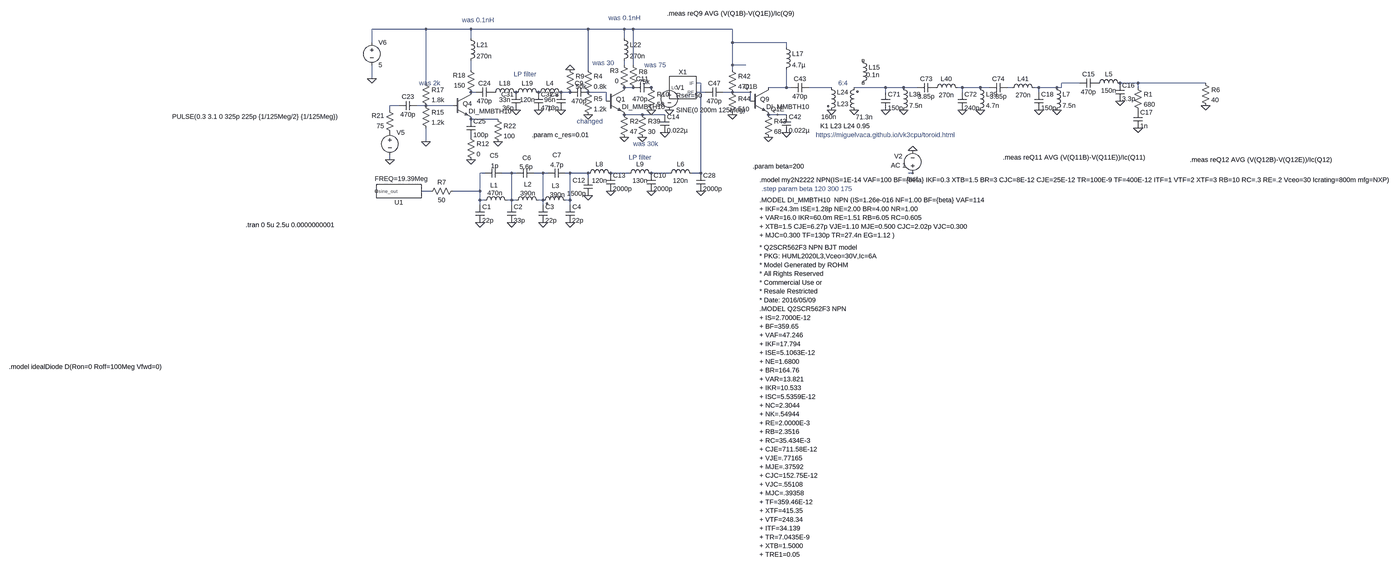
[diagram p0: schematic update_03012022.asc, whole sheet]
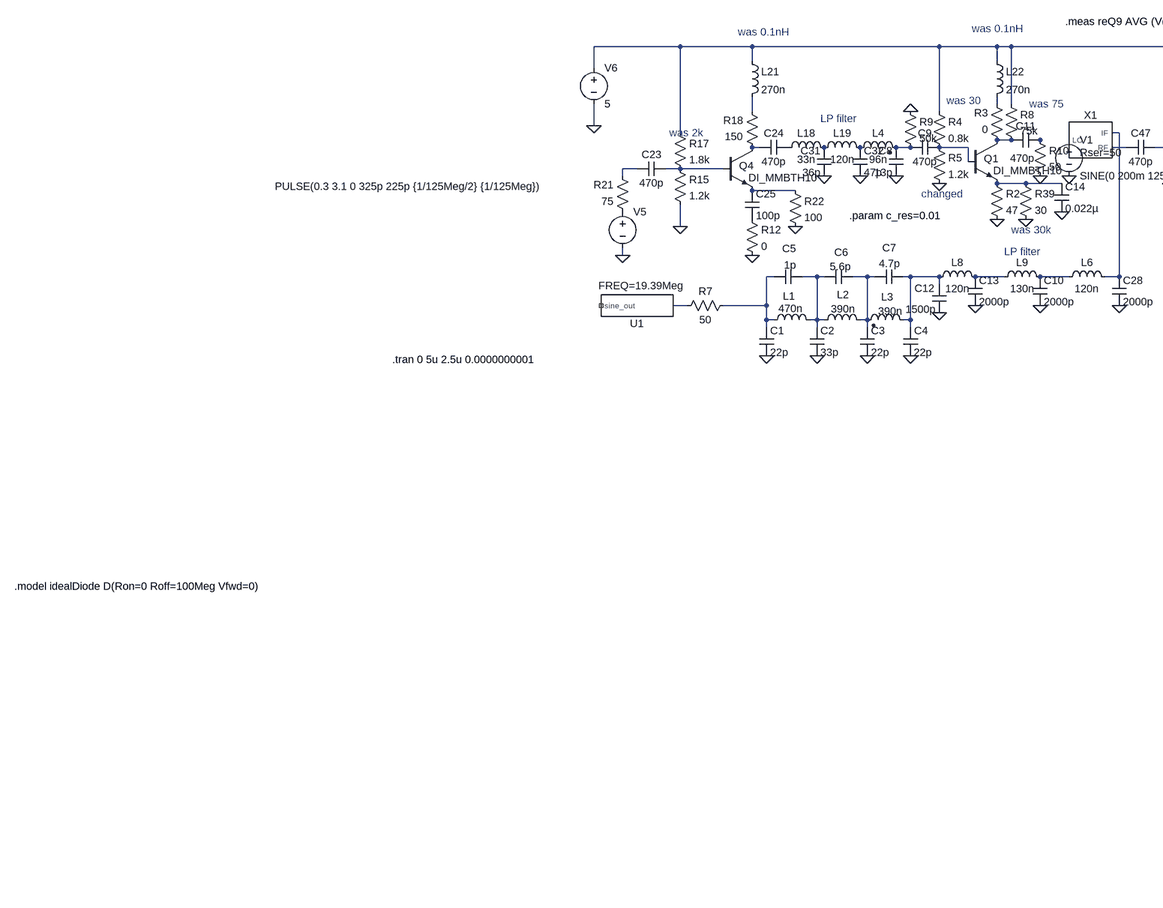
[diagram p1: schematic update_03012022.asc, part, row 1 of 1, column 1 of 2]
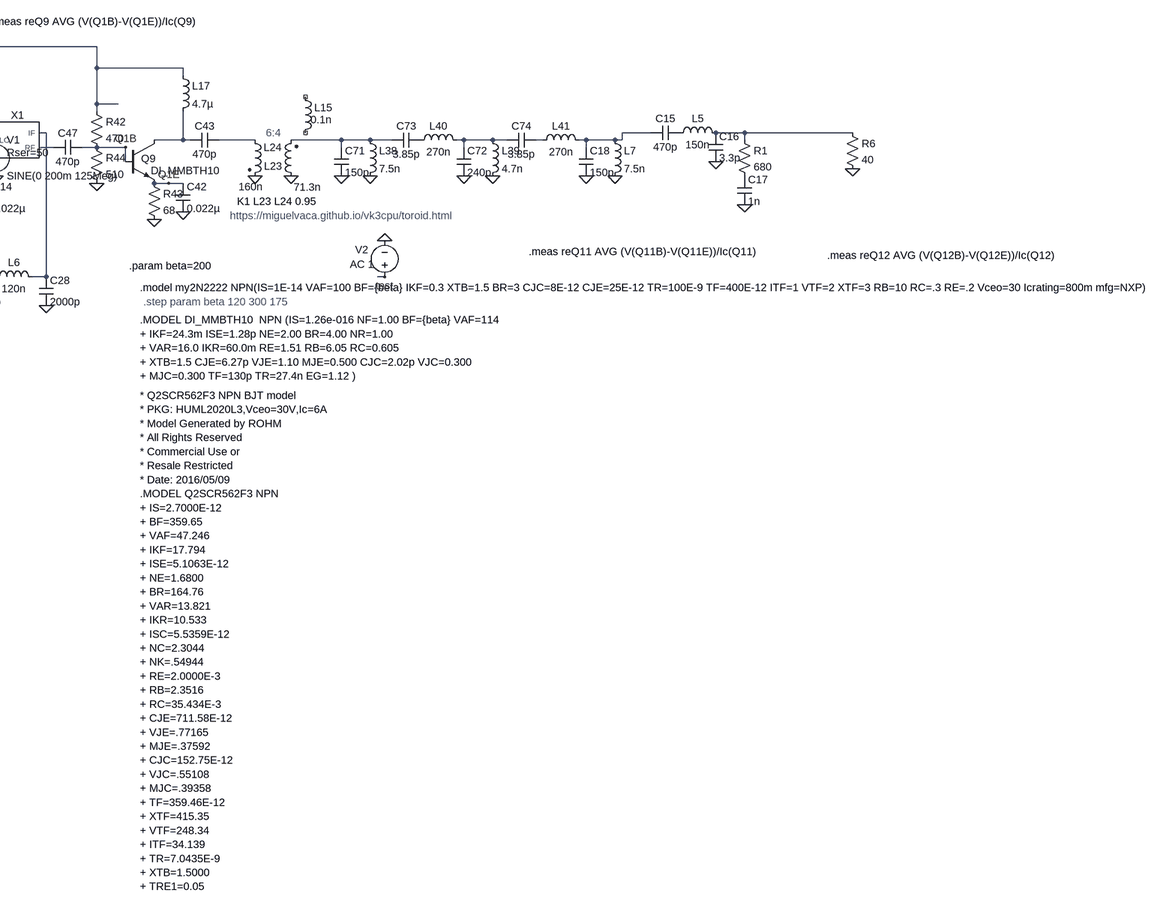
[diagram p2: schematic update_03012022.asc, part, row 1 of 1, column 2 of 2]
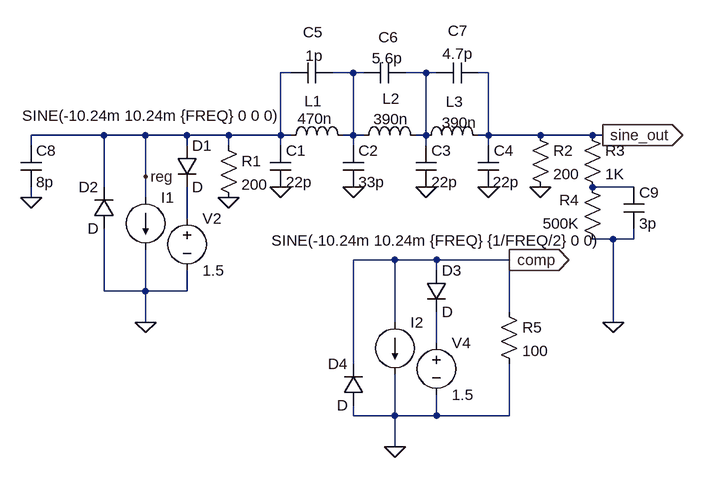
[diagram p3: sub-circuit ad9850.asc]
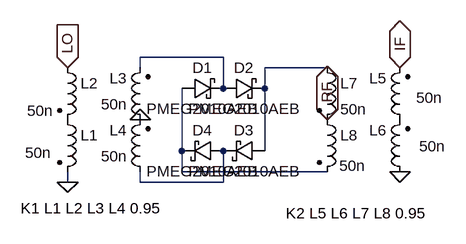
[diagram p4: sub-circuit mixer.asc]
update_03012022.asc, the LTspice schematic file:
Version 4
SHEET 1 5384 1444
WIRE 32 -512 -160 -512
WIRE 192 -512 32 -512
WIRE 608 -512 192 -512
WIRE 736 -512 608 -512
WIRE 768 -512 736 -512
WIRE 1120 -512 768 -512
WIRE 192 -480 192 -512
WIRE 736 -480 736 -512
WIRE -160 -464 -160 -512
WIRE 1120 -464 1120 -512
WIRE 1312 -464 1120 -464
WIRE 1312 -448 1312 -464
WIRE 736 -384 736 -400
WIRE 768 -384 768 -512
WIRE 1120 -384 1120 -464
WIRE 1168 -384 1120 -384
WIRE 192 -368 192 -400
WIRE 608 -368 608 -512
WIRE 1120 -368 1120 -384
WIRE -160 -336 -160 -384
WIRE 32 -320 32 -512
WIRE 1008 -320 992 -320
WIRE 2352 -320 2288 -320
WIRE 2560 -320 2496 -320
WIRE 2800 -320 2560 -320
WIRE 768 -304 736 -304
WIRE 784 -304 768 -304
WIRE 832 -304 816 -304
WIRE 1312 -304 1312 -368
WIRE 1312 -304 1248 -304
WIRE 1328 -304 1312 -304
WIRE 1472 -304 1392 -304
WIRE 1664 -304 1552 -304
WIRE 1728 -304 1664 -304
WIRE 1776 -304 1728 -304
WIRE 1936 -304 1920 -304
WIRE 2000 -304 1936 -304
WIRE 2032 -304 2000 -304
WIRE 2112 -304 2096 -304
WIRE 2208 -304 2192 -304
WIRE 2272 -304 2208 -304
WIRE 2288 -304 2288 -320
WIRE 2288 -304 2272 -304
WIRE 2560 -304 2560 -320
WIRE 208 -288 192 -288
WIRE 544 -288 512 -288
WIRE 608 -288 592 -288
WIRE 672 -288 608 -288
WIRE 1024 -288 992 -288
WIRE 1120 -288 1088 -288
WIRE 1184 -288 1120 -288
WIRE 1664 -288 1664 -304
WIRE 1936 -288 1936 -304
WIRE 2208 -288 2208 -304
WIRE 672 -256 672 -288
WIRE 1184 -256 1184 -288
WIRE -64 -240 -96 -240
WIRE 32 -240 0 -240
WIRE 128 -240 32 -240
WIRE -96 -224 -96 -240
WIRE 800 -208 736 -208
WIRE 880 -208 800 -208
WIRE 1280 -208 1248 -208
WIRE 1312 -208 1280 -208
WIRE 288 -192 192 -192
WIRE 32 -112 32 -160
WIRE -96 -48 -96 -64
WIRE 240 0 224 0
WIRE 336 0 304 0
WIRE 352 0 336 0
WIRE 448 0 416 0
WIRE 464 0 448 0
WIRE 544 0 528 0
WIRE 608 0 544 0
WIRE 752 0 688 0
WIRE 896 0 832 0
WIRE 1008 0 1008 -320
WIRE 1008 0 976 0
WIRE 1760 0 1744 0
WIRE 608 16 608 0
WIRE 48 64 16 64
WIRE 224 64 224 0
WIRE 224 64 128 64
WIRE 224 96 224 64
WIRE 240 96 224 96
WIRE 336 96 336 0
WIRE 336 96 320 96
WIRE 352 96 336 96
WIRE 448 96 448 0
WIRE 448 96 432 96
WIRE 544 96 544 0
WIRE 544 96 528 96
WIRE 224 112 224 96
WIRE 336 112 336 96
WIRE 448 112 448 96
WIRE 544 112 544 96
FLAG 224 176 0
FLAG 336 176 0
FLAG 448 176 0
FLAG 544 176 0
FLAG 688 64 0
FLAG 832 64 0
FLAG -96 -48 0
FLAG -160 -336 0
FLAG 32 -112 0
FLAG 192 -48 0
FLAG 288 -112 0
FLAG 352 -224 0
FLAG 432 -224 0
FLAG 1008 64 0
FLAG 608 80 0
FLAG 512 -224 0
FLAG 608 -208 0
FLAG 736 -128 0
FLAG 880 -144 0
FLAG 800 -128 0
FLAG 1248 -128 0
FLAG 1120 -208 0
FLAG 1312 -144 0
FLAG 1184 -288 Q1B
FLAG 1280 -208 Q1E
FLAG 1472 -224 0
FLAG 1552 -224 0
FLAG 1760 0 test
FLAG 1760 -80 0
FLAG 1664 -224 0
FLAG 1728 -224 0
FLAG 1936 -224 0
FLAG 2000 -224 0
FLAG 2496 -256 0
FLAG 2560 -160 0
FLAG 2800 -240 0
FLAG 544 -368 0
FLAG 896 -224 0
FLAG 832 -224 0
FLAG 2208 -224 0
FLAG 2272 -224 0
SYMBOL AD9850 -64 64 R180
WINDOW 39 -103 44 Left 2
SYMATTR SpiceLine FREQ=19.39Meg
SYMATTR InstName U1
SYMBOL cap 208 112 R0
SYMATTR InstName C1
SYMATTR Value 22p
SYMBOL cap 320 112 R0
SYMATTR InstName C2
SYMATTR Value 33p
SYMBOL cap 432 112 R0
SYMATTR InstName C3
SYMATTR Value 22p
SYMBOL cap 528 112 R0
WINDOW 3 23 56 Left 2
SYMATTR Value 22p
SYMATTR InstName C4
SYMBOL ind 336 112 M270
WINDOW 0 53 62 VTop 2
WINDOW 3 57 59 VBottom 2
SYMATTR InstName L1
SYMATTR Value 470n
SYMBOL ind 448 112 M270
WINDOW 0 57 54 VTop 2
WINDOW 3 56 54 VBottom 2
SYMATTR InstName L2
SYMATTR Value 390n
SYMBOL ind2 544 112 M270
WINDOW 0 52 52 VTop 2
WINDOW 3 51 45 VBottom 2
SYMATTR InstName L3
SYMATTR Value 390n
SYMATTR Type ind
SYMBOL cap 304 -16 R90
WINDOW 0 -31 30 VBottom 2
WINDOW 3 -26 28 VTop 2
SYMATTR InstName C5
SYMATTR Value 1p
SYMBOL cap 416 -16 R90
WINDOW 0 -23 26 VBottom 2
WINDOW 3 -22 28 VTop 2
SYMATTR InstName C6
SYMATTR Value 5.6p
SYMBOL cap 528 -16 R90
WINDOW 0 -33 31 VBottom 2
WINDOW 3 -29 31 VTop 2
SYMATTR InstName C7
SYMATTR Value 4.7p
SYMBOL ind 592 16 R270
WINDOW 0 32 56 VTop 2
WINDOW 3 5 56 VBottom 2
SYMATTR InstName L8
SYMATTR Value 120n
SYMBOL cap 624 80 R180
WINDOW 0 27 54 Left 2
WINDOW 3 24 8 Left 2
SYMATTR InstName C12
SYMATTR Value 1500p
SYMBOL ind 736 16 R270
WINDOW 0 32 56 VTop 2
WINDOW 3 5 56 VBottom 2
SYMATTR InstName L9
SYMATTR Value 130n
SYMBOL cap 672 0 R0
SYMATTR InstName C13
SYMATTR Value 2000p
SYMBOL voltage -96 -160 R0
WINDOW 123 0 0 Left 0
WINDOW 39 0 0 Left 0
WINDOW 3 -773 -41 Left 2
SYMATTR Value PULSE(0.3 3.1 0 325p 225p {1/125Meg/2} {1/125Meg})
SYMATTR InstName V5
SYMBOL npn 128 -288 R0
WINDOW 0 35 41 Left 2
SYMATTR InstName Q4
SYMATTR Value DI_MMBTH10
SYMBOL res 208 -272 R180
WINDOW 0 36 76 Left 2
WINDOW 3 36 40 Left 2
SYMATTR InstName R18
SYMATTR Value 150
SYMBOL voltage -160 -480 R0
WINDOW 123 0 0 Left 0
WINDOW 39 0 0 Left 0
SYMATTR InstName V6
SYMATTR Value 5
SYMBOL cap 0 -256 R90
WINDOW 0 0 32 VBottom 2
WINDOW 3 32 32 VTop 2
SYMATTR InstName C23
SYMATTR Value 470p
SYMBOL res 16 -256 R0
SYMATTR InstName R15
SYMATTR Value 1.2k
SYMBOL res 16 -336 R0
SYMATTR InstName R17
SYMATTR Value 1.8k
SYMBOL cap 176 -192 R0
SYMATTR InstName C25
SYMATTR Value 100p
SYMBOL res 176 -144 R0
SYMATTR InstName R12
SYMATTR Value 0
SYMBOL res -80 -128 R180
WINDOW 0 36 76 Left 2
WINDOW 3 36 40 Left 2
SYMATTR InstName R21
SYMATTR Value 75
SYMBOL cap 272 -304 R90
WINDOW 0 0 32 VBottom 2
WINDOW 3 32 32 VTop 2
SYMATTR InstName C24
SYMATTR Value 470p
SYMATTR SpiceLine Rser={C_RES}
SYMBOL res 272 -208 R0
SYMATTR InstName R22
SYMATTR Value 100
SYMBOL ind 256 -272 R270
WINDOW 0 32 56 VTop 2
WINDOW 3 5 56 VBottom 2
SYMATTR InstName L18
SYMATTR Value 33n
SYMBOL ind 336 -272 R270
WINDOW 0 32 56 VTop 2
WINDOW 3 5 56 VBottom 2
SYMATTR InstName L19
SYMATTR Value 120n
SYMBOL cap 368 -224 R180
WINDOW 0 24 56 Left 2
WINDOW 3 24 8 Left 2
SYMATTR InstName C31
SYMATTR Value 36p
SYMATTR SpiceLine Rser={C_RES}
SYMBOL cap 416 -288 R0
SYMATTR InstName C32
SYMATTR Value 47p
SYMATTR SpiceLine Rser={C_RES}
SYMBOL ind 880 16 R270
WINDOW 0 32 56 VTop 2
WINDOW 3 5 56 VBottom 2
SYMATTR InstName L6
SYMATTR Value 120n
SYMBOL cap 816 0 R0
SYMATTR InstName C10
SYMATTR Value 2000p
SYMBOL cap 992 0 R0
SYMATTR InstName C28
SYMATTR Value 2000p
SYMBOL mixer 944 -304 R0
SYMATTR InstName X1
SYMBOL ind2 416 -272 R270
WINDOW 0 32 56 VTop 2
WINDOW 3 5 56 VBottom 2
SYMATTR InstName L4
SYMATTR Value 96n
SYMATTR Type ind
SYMBOL cap 528 -224 R180
WINDOW 0 24 56 Left 2
WINDOW 3 24 8 Left 2
SYMATTR InstName C8
SYMATTR Value 13p
SYMATTR SpiceLine Rser={C_RES}
SYMBOL npn 672 -304 R0
WINDOW 0 35 41 Left 2
SYMATTR InstName Q1
SYMATTR Value DI_MMBTH10
SYMBOL cap 608 -304 R90
WINDOW 0 0 32 VBottom 2
WINDOW 3 32 32 VTop 2
SYMATTR InstName C9
SYMATTR Value 470p
SYMATTR SpiceLine Rser={C_RES}
SYMBOL res 752 -288 R180
WINDOW 0 36 76 Left 2
WINDOW 3 36 40 Left 2
SYMATTR InstName R3
SYMATTR Value 0
SYMBOL res 592 -384 R0
SYMATTR InstName R4
SYMATTR Value 0.8k
SYMBOL res 592 -304 R0
SYMATTR InstName R5
SYMATTR Value 1.2k
SYMBOL res 720 -224 R0
SYMATTR InstName R2
SYMATTR Value 47
SYMBOL cap 864 -208 R0
SYMATTR InstName C14
SYMATTR Value 0.022µ
SYMBOL cap 832 -320 R90
WINDOW 0 0 32 VBottom 2
WINDOW 3 41 40 VTop 2
SYMATTR InstName C11
SYMATTR Value 470p
SYMBOL ind 176 -496 R0
SYMATTR InstName L21
SYMATTR Value 270n
SYMBOL ind 720 -496 R0
SYMATTR InstName L22
SYMATTR Value 270n
SYMBOL res 784 -224 R0
SYMATTR InstName R39
SYMATTR Value 30
SYMBOL npn 1184 -304 R0
WINDOW 0 35 41 Left 2
SYMATTR InstName Q9
SYMATTR Value DI_MMBTH10
SYMBOL res 1104 -384 R0
SYMATTR InstName R42
SYMATTR Value 470
SYMBOL res 1232 -224 R0
SYMATTR InstName R43
SYMATTR Value 68
SYMBOL cap 1296 -208 R0
SYMATTR InstName C42
SYMATTR Value 0.022µ
SYMBOL cap 1392 -320 R90
WINDOW 0 0 32 VBottom 2
WINDOW 3 32 32 VTop 2
SYMATTR InstName C43
SYMATTR Value 470p
SYMBOL cap 1088 -304 R90
WINDOW 0 0 32 VBottom 2
WINDOW 3 32 32 VTop 2
SYMATTR InstName C47
SYMATTR Value 470p
SYMBOL ind 1568 -416 R0
WINDOW 3 27 67 Left 2
SYMATTR Value 0.1n
SYMATTR InstName L15
SYMBOL res 1104 -304 R0
SYMATTR InstName R44
SYMATTR Value 510
SYMBOL ind 1296 -464 R0
SYMATTR InstName L17
SYMATTR Value 4.7µ
SYMBOL ind2 1456 -320 R0
WINDOW 0 36 74 Left 2
WINDOW 3 -21 120 Left 2
SYMATTR InstName L23
SYMATTR Value 160n
SYMATTR Type ind
SYMBOL ind2 1568 -208 R180
WINDOW 0 36 80 Left 2
WINDOW 3 -51 -9 Left 2
SYMATTR InstName L24
SYMATTR Value 71.3n
SYMATTR Type ind
SYMBOL voltage 1760 16 R180
WINDOW 123 24 44 Left 2
WINDOW 39 0 0 Left 0
WINDOW 0 36 76 Left 2
SYMATTR Value2 AC 1
SYMATTR InstName V2
SYMATTR Value ""
SYMBOL cap 1648 -288 R0
SYMATTR InstName C71
SYMATTR Value 150p
SYMATTR SpiceLine Rser=.1
SYMBOL ind 1712 -320 R0
SYMATTR InstName L38
SYMATTR Value 7.5n
SYMATTR SpiceLine Rser=.1
SYMBOL cap 1920 -288 R0
SYMATTR InstName C72
SYMATTR Value 240p
SYMATTR SpiceLine Rser=.1
SYMBOL ind 1984 -320 R0
SYMATTR InstName L39
SYMATTR Value 4.7n
SYMATTR SpiceLine Rser=.1
SYMBOL cap 1840 -320 R90
WINDOW 0 0 32 VBottom 2
WINDOW 3 32 32 VTop 2
SYMATTR InstName C73
SYMATTR Value 3.85p
SYMATTR SpiceLine Rser=.1
SYMBOL ind 1824 -288 R270
WINDOW 0 32 56 VTop 2
WINDOW 3 5 56 VBottom 2
SYMATTR InstName L40
SYMATTR Value 270n
SYMATTR SpiceLine Rser=.1
SYMBOL ind 2096 -288 R270
WINDOW 0 32 56 VTop 2
WINDOW 3 5 56 VBottom 2
SYMATTR InstName L41
SYMATTR Value 270n
SYMATTR SpiceLine Rser=1
SYMBOL cap 2096 -320 R90
WINDOW 0 0 32 VBottom 2
WINDOW 3 32 32 VTop 2
SYMATTR InstName C74
SYMATTR Value 3.85p
SYMATTR SpiceLine Rser=.1
SYMBOL cap 2416 -336 R90
WINDOW 0 0 32 VBottom 2
WINDOW 3 32 32 VTop 2
SYMATTR InstName C15
SYMATTR Value 470p
SYMATTR SpiceLine Rser=.1
SYMBOL ind 2400 -304 R270
WINDOW 0 32 56 VTop 2
WINDOW 3 5 56 VBottom 2
SYMATTR InstName L5
SYMATTR Value 150n
SYMATTR SpiceLine Rser=.1
SYMBOL cap 2480 -320 R0
SYMATTR InstName C16
SYMATTR Value 3.3p
SYMATTR SpiceLine Rser=.1
SYMBOL cap 2544 -224 R0
SYMATTR InstName C17
SYMATTR Value 1n
SYMBOL res 2544 -320 R0
SYMATTR InstName R1
SYMATTR Value 680
SYMBOL res 2784 -336 R0
SYMATTR InstName R6
SYMATTR Value 40
SYMBOL res 752 -400 R0
SYMATTR InstName R8
SYMATTR Value 75k
SYMBOL res 144 48 R90
WINDOW 0 0 56 VBottom 2
WINDOW 3 32 56 VTop 2
SYMATTR InstName R7
SYMATTR Value 50
SYMBOL res 528 -384 R0
SYMATTR InstName R9
SYMATTR Value 50k
SYMBOL voltage 896 -320 R0
WINDOW 123 0 0 Left 0
WINDOW 39 24 44 Left 2
SYMATTR SpiceLine Rser=50
SYMATTR InstName V1
SYMATTR Value SINE(0 200m 125Meg)
SYMBOL res 816 -320 R0
SYMATTR InstName R10
SYMATTR Value 50
SYMBOL cap 2192 -288 R0
SYMATTR InstName C18
SYMATTR Value 150p
SYMATTR SpiceLine Rser=.1
SYMBOL ind 2256 -320 R0
SYMATTR InstName L7
SYMATTR Value 7.5n
SYMATTR SpiceLine Rser=.1
TEXT -608 184 Left 2 !.tran 0 5u 2.5u 0.0000000001
TEXT 752 -56 Left 2 ;LP filter
TEXT -1448 688 Left 2 !.model idealDiode D(Ron=0 Roff=100Meg Vfwd=0)
TEXT 408 -136 Left 2 !.param c_res=0.01
TEXT 344 -352 Left 2 ;LP filter
TEXT 1216 24 Left 2 !.model my2N2222 NPN(IS=1E-14 VAF=100 BF={beta} IKF=0.3 XTB=1.5 BR=3 CJC=8E-12 CJE=25E-12 TR=100E-9 TF=400E-12 ITF=1 VTF=2 XTF=3 RB=10 RC=.3 RE=.2 Vceo=30 Icrating=800m mfg=NXP)
TEXT 1224 56 Left 2 ;.step param beta 120 300 175
TEXT 1216 96 Left 2 !.MODEL DI_MMBTH10  NPN (IS=1.26e-016 NF=1.00 BF={beta} VAF=114\n+ IKF=24.3m ISE=1.28p NE=2.00 BR=4.00 NR=1.00\n+ VAR=16.0 IKR=60.0m RE=1.51 RB=6.05 RC=0.605\n+ XTB=1.5 CJE=6.27p VJE=1.10 MJE=0.500 CJC=2.02p VJC=0.300\n+ MJC=0.300 TF=130p TR=27.4n EG=1.12 )
TEXT 1496 -320 Left 2 ;6:4
TEXT 1432 -168 Left 2 !K1 L23 L24 0.95
TEXT 888 -568 Left 2 !.meas reQ9 AVG (V(Q1B)-V(Q1E))/Ic(Q9)
TEXT 2080 -56 Left 2 !.meas reQ11 AVG (V(Q11B)-V(Q11E))/Ic(Q11)
TEXT 1192 -24 Left 2 !.param beta=200
TEXT 2744 -48 Left 2 !.meas reQ12 AVG (V(Q12B)-V(Q12E))/Ic(Q12)
TEXT 1216 264 Left 2 !* Q2SCR562F3 NPN BJT model\n* PKG: HUML2020L3,Vceo=30V,Ic=6A\n* Model Generated by ROHM\n* All Rights Reserved\n* Commercial Use or\n* Resale Restricted\n* Date: 2016/05/09\n.MODEL Q2SCR562F3 NPN\n+ IS=2.7000E-12\n+ BF=359.65\n+ VAF=47.246\n+ IKF=17.794\n+ ISE=5.1063E-12\n+ NE=1.6800\n+ BR=164.76\n+ VAR=13.821\n+ IKR=10.533\n+ ISC=5.5359E-12\n+ NC=2.3044\n+ NK=.54944\n+ RE=2.0000E-3\n+ RB=2.3516\n+ RC=35.434E-3\n+ CJE=711.58E-12\n+ VJE=.77165\n+ MJE=.37592\n+ CJC=152.75E-12\n+ VJC=.55108\n+ MJC=.39358\n+ TF=359.46E-12\n+ XTF=415.35\n+ VTF=248.34\n+ ITF=34.139\n+ TR=7.0435E-9\n+ XTB=1.5000\n+ TRE1=0.05
TEXT 8 -320 Left 2 ;was 2k
TEXT 160 -544 Left 2 ;was 0.1nH
TEXT 680 -552 Left 2 ;was 0.1nH
TEXT 808 -384 Left 2 ;was 75
TEXT 768 -104 Left 2 ;was 30k
TEXT 624 -392 Left 2 ;was 30
TEXT 568 -184 Left 2 ;changed
TEXT 1416 -136 Left 2 ;https://miguelvaca.github.io/vk3cpu/toroid.html

ad9850.asc, the sub-circuit schematic file:
Version 4
SHEET 1 1172 680
WIRE 192 -16 176 -16
WIRE 288 -16 256 -16
WIRE 304 -16 288 -16
WIRE 400 -16 368 -16
WIRE 416 -16 400 -16
WIRE 496 -16 480 -16
WIRE -96 80 -208 80
WIRE -32 80 -96 80
WIRE 32 80 -32 80
WIRE 96 80 32 80
WIRE 176 80 176 -16
WIRE 176 80 96 80
WIRE 192 80 176 80
WIRE 288 80 288 -16
WIRE 288 80 272 80
WIRE 304 80 288 80
WIRE 400 80 400 -16
WIRE 400 80 384 80
WIRE 496 80 496 -16
WIRE 496 80 480 80
WIRE 576 80 496 80
WIRE 656 80 576 80
WIRE 672 80 656 80
WIRE -208 96 -208 80
WIRE 32 96 32 80
WIRE 96 96 96 80
WIRE 176 96 176 80
WIRE 288 96 288 80
WIRE 400 96 400 80
WIRE 496 96 496 80
WIRE -32 144 -32 80
WIRE -96 160 -96 80
WIRE 720 160 656 160
WIRE -208 176 -208 160
WIRE -32 176 -32 144
WIRE 32 208 32 160
WIRE 688 240 656 240
WIRE 720 240 720 224
WIRE 720 240 688 240
WIRE 352 272 288 272
WIRE 416 272 352 272
WIRE 528 272 416 272
WIRE 416 288 416 272
WIRE -96 320 -96 224
WIRE -32 320 -32 256
WIRE -32 320 -96 320
WIRE 32 320 32 288
WIRE 32 320 -32 320
WIRE 528 352 528 272
WIRE -32 368 -32 320
WIRE 352 368 352 272
WIRE 688 368 688 240
WIRE 416 400 416 352
WIRE 288 432 288 272
WIRE 288 512 288 496
WIRE 352 512 352 448
WIRE 352 512 288 512
WIRE 416 512 416 480
WIRE 416 512 352 512
WIRE 528 512 528 432
WIRE 528 512 416 512
WIRE 352 560 352 512
FLAG -32 368 0
FLAG 96 176 0
FLAG 176 160 0
FLAG 288 160 0
FLAG 400 160 0
FLAG 496 160 0
FLAG 576 160 0
FLAG 672 80 sine_out
IOPIN 672 80 Out
FLAG -208 176 0
FLAG 688 368 0
FLAG 352 560 0
FLAG 528 272 comp
IOPIN 528 272 Out
FLAG -32 144 reg
SYMBOL current -32 176 R0
WINDOW 3 -190 -126 Left 2
WINDOW 123 0 0 Left 0
WINDOW 39 24 28 Left 2
SYMATTR Value SINE(-10.24m 10.24m {FREQ} 0 0 0)
SYMATTR InstName I1
SYMBOL res 80 80 R0
SYMATTR InstName R1
SYMATTR Value 200
SYMBOL res 560 64 R0
SYMATTR InstName R2
SYMATTR Value 200
SYMBOL cap 160 96 R0
SYMATTR InstName C1
SYMATTR Value 22p
SYMBOL cap 272 96 R0
SYMATTR InstName C2
SYMATTR Value 33p
SYMBOL cap 384 96 R0
SYMATTR InstName C3
SYMATTR Value 22p
SYMBOL cap 480 96 R0
WINDOW 3 23 56 Left 2
SYMATTR Value 22p
SYMATTR InstName C4
SYMBOL ind 288 96 M270
WINDOW 0 53 62 VTop 2
WINDOW 3 57 59 VBottom 2
SYMATTR InstName L1
SYMATTR Value 470n
SYMBOL ind 400 96 M270
WINDOW 0 57 54 VTop 2
WINDOW 3 56 54 VBottom 2
SYMATTR InstName L2
SYMATTR Value 390n
SYMBOL ind 496 96 M270
WINDOW 0 52 52 VTop 2
WINDOW 3 51 45 VBottom 2
SYMATTR InstName L3
SYMATTR Value 390n
SYMBOL cap 256 -32 R90
WINDOW 0 -31 30 VBottom 2
WINDOW 3 -26 28 VTop 2
SYMATTR InstName C5
SYMATTR Value 1p
SYMBOL cap 368 -32 R90
WINDOW 0 -23 26 VBottom 2
WINDOW 3 -22 28 VTop 2
SYMATTR InstName C6
SYMATTR Value 5.6p
SYMBOL cap 480 -32 R90
WINDOW 0 -33 31 VBottom 2
WINDOW 3 -29 31 VTop 2
SYMATTR InstName C7
SYMATTR Value 4.7p
SYMBOL cap -224 96 R0
SYMATTR InstName C8
SYMATTR Value 8p
SYMBOL diode 16 96 R0
SYMATTR InstName D1
SYMBOL diode -80 224 R180
WINDOW 0 24 64 Left 2
WINDOW 3 24 0 Left 2
SYMATTR InstName D2
SYMBOL voltage 32 192 R0
WINDOW 123 0 0 Left 0
WINDOW 39 0 0 Left 0
SYMATTR InstName V2
SYMATTR Value 1.5
SYMBOL res 640 64 R0
SYMATTR InstName R3
SYMATTR Value 1K
SYMBOL res 672 256 R180
WINDOW 0 36 76 Left 2
WINDOW 3 36 40 Left 2
SYMATTR InstName R4
SYMATTR Value 500K
SYMBOL cap 704 160 R0
SYMATTR InstName C9
SYMATTR Value 3p
SYMBOL current 352 368 R0
WINDOW 3 -190 -126 Left 2
WINDOW 123 0 0 Left 0
WINDOW 39 24 28 Left 2
SYMATTR Value SINE(-10.24m 10.24m {FREQ} {1/FREQ/2} 0 0)
SYMATTR InstName I2
SYMBOL diode 400 288 R0
SYMATTR InstName D3
SYMBOL diode 304 496 R180
WINDOW 0 24 64 Left 2
WINDOW 3 24 0 Left 2
SYMATTR InstName D4
SYMBOL voltage 416 384 R0
WINDOW 123 0 0 Left 0
WINDOW 39 0 0 Left 0
SYMATTR InstName V4
SYMATTR Value 1.5
SYMBOL res 512 336 R0
SYMATTR InstName R5
SYMATTR Value 100

mixer.asc, the sub-circuit schematic file:
Version 4
SHEET 1 1072 680
WIRE 256 32 128 32
WIRE 128 48 128 32
WIRE 416 48 320 48
WIRE 256 80 256 32
WIRE 320 80 320 48
WIRE 192 176 192 80
WIRE 320 176 320 80
WIRE 192 208 192 176
WIRE 416 208 192 208
WIRE 16 224 16 208
WIRE 128 224 128 208
WIRE 256 224 256 176
WIRE 256 224 128 224
FLAG 416 128 RF
IOPIN 416 128 BiDir
FLAG 16 48 LO
IOPIN 16 48 In
FLAG 528 48 IF
IOPIN 528 48 BiDir
FLAG 528 208 0
FLAG 16 224 0
FLAG 128 128 0
SYMBOL ind2 0 112 R0
WINDOW 3 -49 67 Left 2
SYMATTR Value 50n
SYMATTR InstName L1
SYMATTR Type ind
SYMBOL ind2 0 32 R0
WINDOW 3 -46 82 Left 2
SYMATTR Value 50n
SYMATTR InstName L2
SYMATTR Type ind
SYMBOL ind2 144 144 R180
WINDOW 0 36 80 Left 2
WINDOW 3 36 40 Left 2
SYMATTR InstName L3
SYMATTR Value 50n
SYMATTR Type ind
SYMBOL ind2 144 224 R180
WINDOW 0 36 80 Left 2
WINDOW 3 36 40 Left 2
SYMATTR InstName L4
SYMATTR Value 50n
SYMATTR Type ind
SYMBOL ind2 544 144 R180
WINDOW 0 36 80 Left 2
WINDOW 3 -50 50 Left 2
SYMATTR InstName L5
SYMATTR Value 50n
SYMATTR Type ind
SYMBOL ind2 544 224 R180
WINDOW 0 36 80 Left 2
WINDOW 3 -54 55 Left 2
SYMATTR InstName L6
SYMATTR Value 50n
SYMATTR Type ind
SYMBOL ind2 400 32 R0
SYMATTR InstName L7
SYMATTR Value 50n
SYMATTR Type ind
SYMBOL ind2 400 112 R0
WINDOW 3 35 87 Left 2
SYMATTR Value 50n
SYMATTR InstName L8
SYMATTR Type ind
SYMBOL schottky 192 96 R270
WINDOW 0 32 32 VTop 2
WINDOW 3 0 32 VBottom 2
SYMATTR InstName D1
SYMATTR Value PMEG2010AEB
SYMATTR Description Diode
SYMATTR Type diode
SYMBOL schottky 256 96 R270
WINDOW 0 32 32 VTop 2
WINDOW 3 0 32 VBottom 2
SYMATTR InstName D2
SYMATTR Value PMEG2010AEB
SYMATTR Description Diode
SYMATTR Type diode
SYMBOL schottky 320 160 R90
WINDOW 0 0 32 VBottom 2
WINDOW 3 32 32 VTop 2
SYMATTR InstName D3
SYMATTR Value PMEG2010AEB
SYMATTR Description Diode
SYMATTR Type diode
SYMBOL schottky 256 160 R90
WINDOW 0 0 32 VBottom 2
WINDOW 3 32 32 VTop 2
SYMATTR InstName D4
SYMATTR Value PMEG2010AEB
SYMATTR Description Diode
SYMATTR Type diode
TEXT -56 264 Left 2 !K1 L1 L2 L3 L4 0.95
TEXT 352 272 Left 2 !K2 L5 L6 L7 L8 0.95

The netlist it stands for:
* update_03012022.asc
XU1 NC_01 N028 ad9850 params: FREQ=19.39Meg
C1 N022 0 22p
C2 N023 0 33p
C3 N024 0 22p
C4 N025 0 22p
L1 N023 N022 470n
L2 N024 N023 390n
L3 N025 N024 390n
C5 N023 N022 1p
C6 N024 N023 5.6p
C7 N025 N024 4.7p
L8 N025 N026 120n
C12 0 N025 1500p
L9 N026 N027 130n
C13 N026 0 2000p
V5 P001 0 PULSE(0.3 3.1 0 325p 225p {1/125Meg/2} {1/125Meg})
Q4 N014 N019 N021 0 DI_MMBTH10
R18 N014 N003 150
V6 N001 0 5
C23 N019 N018 470p
R15 N019 0 1.2k
R17 N001 N019 1.8k
C25 N021 P002 100p
R12 P002 0 0
R21 P001 N018 75
C24 P003 N014 470p Rser={C_RES}
R22 N021 0 100
L18 P003 P004 33n
L19 P004 P005 120n
C31 0 P004 36p Rser={C_RES}
C32 P005 0 47p Rser={C_RES}
L6 N027 N004 120n
C10 N027 0 2000p
C28 N004 0 2000p
XX1 P006 N004 N017 mixer
L4 P005 N015 96n
C8 0 N015 13p Rser={C_RES}
Q1 N007 N016 N020 0 DI_MMBTH10
C9 N016 N015 470p Rser={C_RES}
R3 N007 N002 0
R4 N001 N016 0.8k
R5 N016 0 1.2k
R2 N020 0 47
C14 N020 0 0.022µ
C11 N008 N007 470p
L21 N001 N003 270n
L22 N001 N002 270n
R39 N020 0 30
Q9 N009 Q1B Q1E 0 DI_MMBTH10
R42 N001 Q1B 470
R43 Q1E 0 68
C42 Q1E 0 0.022µ
C43 N010 N009 470p
C47 Q1B N017 470p
L15 NC_02 NC_03 0.1n
R44 Q1B 0 510
L17 N001 N009 4.7µ
L23 N010 0 160n
L24 0 N011 71.3n
V2 test 0 AC 1
C71 N011 0 150p Rser=.1
L38 N011 0 7.5n Rser=.1
C72 N012 0 240p Rser=.1
L39 N012 0 4.7n Rser=.1
C73 P007 N011 3.85p Rser=.1
L40 P007 N012 270n Rser=.1
L41 N013 N005 270n Rser=1
C74 N013 N012 3.85p Rser=.1
C15 P008 N005 470p Rser=.1
L5 P008 N006 150n Rser=.1
C16 N006 0 3.3p Rser=.1
C17 P009 0 1n
R1 N006 P009 680
R6 N006 0 40
R8 N001 N007 75k
R7 N022 N028 50
R9 0 N015 50k
V1 P006 0 SINE(0 200m 125Meg) Rser=50
R10 N008 0 50
C18 N005 0 150p Rser=.1
L7 N005 0 7.5n Rser=.1

* block symbol definitions
.subckt ad9850 sine_out comp
I1 reg 0 SINE(-10.24m 10.24m {FREQ} 0 0 0)
R1 reg 0 200
R2 sine_out 0 200
C1 reg 0 22p
C2 N001 0 33p
C3 N002 0 22p
C4 sine_out 0 22p
L1 N001 reg 470n
L2 N002 N001 390n
L3 sine_out N002 390n
C5 N001 reg 1p
C6 N002 N001 5.6p
C7 sine_out N002 4.7p
C8 reg 0 8p
D1 reg N004 D
D2 0 reg D
V2 N004 0 1.5
R3 sine_out N003 1K
R4 0 N003 500K
C9 N003 0 3p
I2 comp 0 SINE(-10.24m 10.24m {FREQ} {1/FREQ/2} 0 0)
D3 comp N005 D
D4 0 comp D
V4 N005 0 1.5
R5 comp 0 100
.ends ad9850

.subckt mixer LO IF RF
L1 P001 0 50n
L2 LO P001 50n
L3 0 N001 50n
L4 N004 0 50n
L5 P002 IF 50n
L6 0 P002 50n
L7 N002 RF 50n
L8 RF N003 50n
D1 N003 N001 PMEG2010AEB
D2 N001 N002 PMEG2010AEB
D3 N002 N004 PMEG2010AEB
D4 N004 N003 PMEG2010AEB
K1 L1 L2 L3 L4 0.95
K2 L5 L6 L7 L8 0.95
.ends mixer

.model D D
.lib standard.dio
.model NPN NPN
.model PNP PNP
.lib standard.bjt
.tran 0 5u 2.5u 0.0000000001
* LP filter
.model idealDiode D(Ron=0 Roff=100Meg Vfwd=0)
.param c_res=0.01
* LP filter
.model my2N2222 NPN(IS=1E-14 VAF=100 BF={beta} IKF=0.3 XTB=1.5 BR=3 CJC=8E-12 CJE=25E-12 TR=100E-9 TF=400E-12 ITF=1 VTF=2 XTF=3 RB=10 RC=.3 RE=.2 Vceo=30 Icrating=800m mfg=NXP)
* .step param beta 120 300 175
.MODEL DI_MMBTH10  NPN (IS=1.26e-016 NF=1.00 BF={beta} VAF=114
+ IKF=24.3m ISE=1.28p NE=2.00 BR=4.00 NR=1.00
+ VAR=16.0 IKR=60.0m RE=1.51 RB=6.05 RC=0.605
+ XTB=1.5 CJE=6.27p VJE=1.10 MJE=0.500 CJC=2.02p VJC=0.300
+ MJC=0.300 TF=130p TR=27.4n EG=1.12 )
* 6:4
K1 L23 L24 0.95
.meas reQ9 AVG (V(Q1B)-V(Q1E))/Ic(Q9)
.meas reQ11 AVG (V(Q11B)-V(Q11E))/Ic(Q11)
.param beta=200
.meas reQ12 AVG (V(Q12B)-V(Q12E))/Ic(Q12)
* Q2SCR562F3 NPN BJT model
* PKG: HUML2020L3,Vceo=30V,Ic=6A
* Model Generated by ROHM
* All Rights Reserved
* Commercial Use or
* Resale Restricted
* Date: 2016/05/09
.MODEL Q2SCR562F3 NPN
+ IS=2.7000E-12
+ BF=359.65
+ VAF=47.246
+ IKF=17.794
+ ISE=5.1063E-12
+ NE=1.6800
+ BR=164.76
+ VAR=13.821
+ IKR=10.533
+ ISC=5.5359E-12
+ NC=2.3044
+ NK=.54944
+ RE=2.0000E-3
+ RB=2.3516
+ RC=35.434E-3
+ CJE=711.58E-12
+ VJE=.77165
+ MJE=.37592
+ CJC=152.75E-12
+ VJC=.55108
+ MJC=.39358
+ TF=359.46E-12
+ XTF=415.35
+ VTF=248.34
+ ITF=34.139
+ TR=7.0435E-9
+ XTB=1.5000
+ TRE1=0.05
* was 2k
* was 0.1nH
* was 0.1nH
* was 75
* was 30k
* was 30
* changed
* https://miguelvaca.github.io/vk3cpu/toroid.html
.backanno
.end